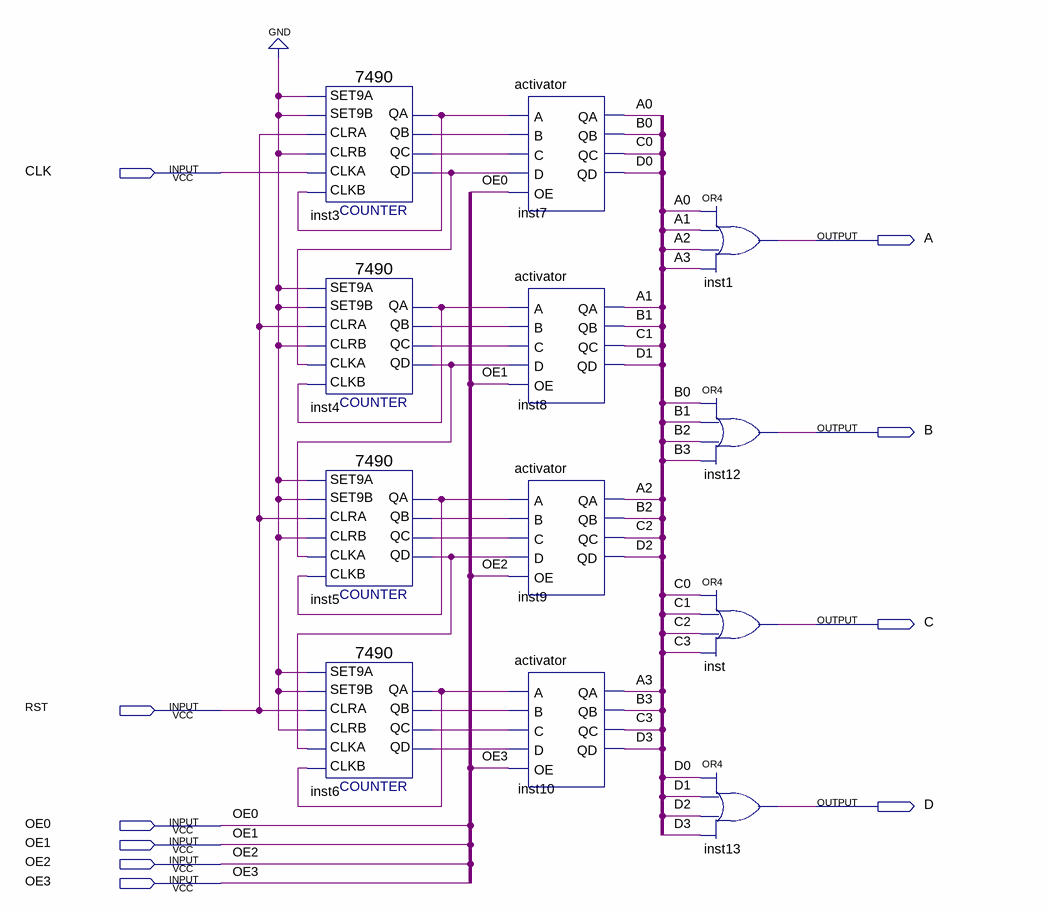
[diagram p0: schematic sheet]
// Quartus schematic 4digit_bcd_counter.bdf as structural Verilog: 12 symbols, 10 pins
module \4digit_bcd_counter  (
  input  CLK,
  input  RST,
  input  OE0,
  input  OE1,
  input  OE2,
  input  OE3,
  output A,
  output B,
  output C,
  output D
);

  wire A0, A1, A2, A3, B0, B1, B2, B3, C0, C1, C2, C3, D0, D1, D2, D3, inst3_qa, inst3_qb, inst3_qc,
       inst3_qd, inst4_qa, inst4_qb, inst4_qc, inst4_qd, inst5_qa, inst5_qb, inst5_qc, inst5_qd, inst6_qa,
       inst6_qb, inst6_qc, inst6_qd;

  \7490  inst3 (
    .SET9A(1'b0), .CLRA(RST), .SET9B(1'b0), .CLKB(inst3_qa), .CLKA(CLK), .CLRB(1'b0), .QD(inst3_qd),
    .QA(inst3_qa), .QB(inst3_qb), .QC(inst3_qc));
  \7490  inst4 (
    .SET9A(1'b0), .CLRA(RST), .SET9B(1'b0), .CLKB(inst4_qa), .CLKA(inst3_qd), .CLRB(1'b0), .QD(inst4_qd),
    .QA(inst4_qa), .QB(inst4_qb), .QC(inst4_qc));
  \7490  inst5 (
    .SET9A(1'b0), .CLRA(RST), .SET9B(1'b0), .CLKB(inst5_qa), .CLKA(inst4_qd), .CLRB(1'b0), .QD(inst5_qd),
    .QA(inst5_qa), .QB(inst5_qb), .QC(inst5_qc));
  \7490  inst6 (
    .SET9A(1'b0), .CLRA(RST), .SET9B(1'b0), .CLKB(inst6_qa), .CLKA(inst5_qd), .CLRB(1'b0), .QD(inst6_qd),
    .QA(inst6_qa), .QB(inst6_qb), .QC(inst6_qc));
  activator inst7 (
    .A(inst3_qa), .B(inst3_qb), .C(inst3_qc), .D(inst3_qd), .OE(OE0), .QA(A0), .QB(B0), .QC(C0), .QD(D0));
  activator inst8 (
    .A(inst4_qa), .B(inst4_qb), .C(inst4_qc), .D(inst4_qd), .OE(OE1), .QA(A1), .QB(B1), .QC(C1), .QD(D1));
  activator inst9 (
    .A(inst5_qa), .B(inst5_qb), .C(inst5_qc), .D(inst5_qd), .OE(OE2), .QA(A2), .QB(B2), .QC(C2), .QD(D2));
  activator inst10 (
    .A(inst6_qa), .B(inst6_qb), .C(inst6_qc), .D(inst6_qd), .OE(OE3), .QA(A3), .QB(B3), .QC(C3), .QD(D3));
  or inst1 (A, A0, A1, A2, A3);
  or inst12 (B, B0, B1, B2, B3);
  or inst (C, C0, C1, C2, C3);
  or inst13 (D, D0, D1, D2, D3);
endmodule
